# EAGLE design DMX module (EAGLE 8.7.1)
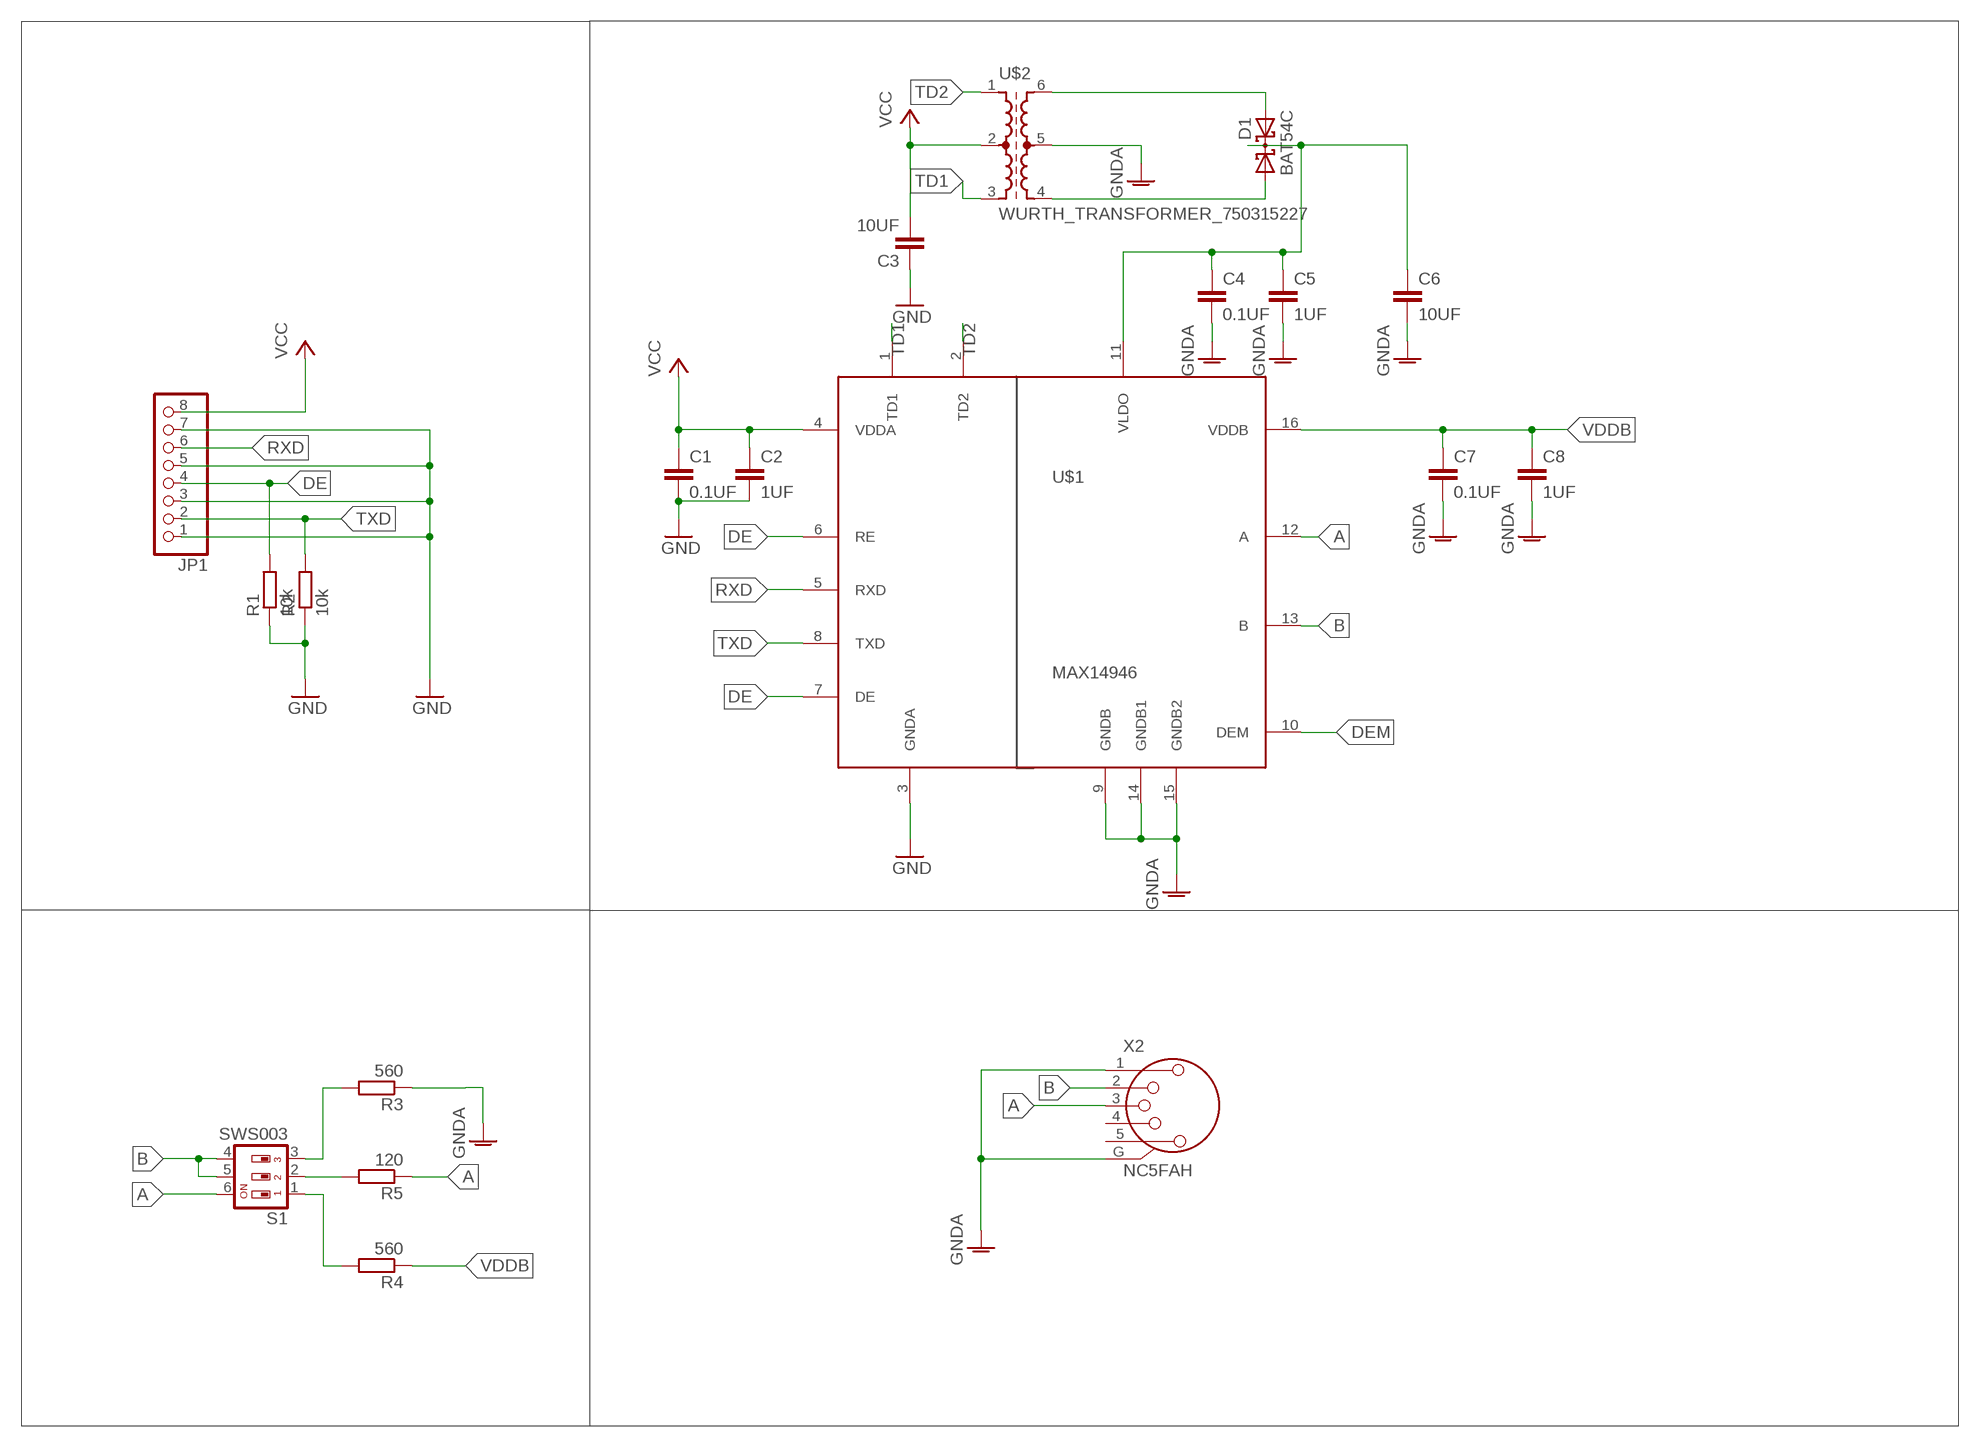
[diagram p0: schematic, sheet 1]

## Parts
C1  0.1UF  C-EUC0603  [C0603]
C2  1UF  C-EUC0603  [C0603]
C3  10UF  C-EUC0805  [C0805]
C4  0.1UF  C-EUC0603  [C0603]
C5  1UF  C-EUC0603  [C0603]
C6  10UF  C-EUC0805  [C0805]
C7  0.1UF  C-EUC0603  [C0603]
C8  1UF  C-EUC0603  [C0603]
D1  BAT54C  [SOT23]
JP1  PINHD-1X8/90  [1X08/90]
R1  10k  R-EU_R0603  [R0603]
R2  10k  R-EU_R0603  [R0603]
R3  560  R-EU_R0603  [R0603]
R4  560  R-EU_R0603  [R0603]
R5  120  R-EU_R0603  [R0603]
S1  SWS003  [SMS-003]
U$1  MAX14946  [SOIC16W]
U$2  WURTH_TRANSFORMER_750315227  [WURTH750315227]
X2  NC5FAH  [NC5FAH]

## Nets
A: R5.1 S1.6 U$1.12(A) X2.3
B: S1.4 S1.5 U$1.13(B) X2.2
DE: JP1.4 R1.2 U$1.6(RE) U$1.7(DE)
DEM: U$1.10(DEM)
GND: C1.2 C2.2 C3.1 JP1.1 JP1.3 JP1.5 JP1.7 R1.1 R2.1 U$1.3(GNDA)
GNDA: C4.2 C5.2 C6.2 C7.2 C8.2 R3.1 U$1.9(GNDB) U$1.14(GNDB1) U$1.15(GNDB2) U$2.5 X2.1 X2.G
N$1: R5.2 S1.2
N$2: R4.2 S1.1
N$3: D1.1(A1) U$2.4
N$4: D1.2(A2) U$2.6
N$5: C4.1 C5.1 C6.1 D1.3(CC) U$1.11(VLDO)
N$6: R3.2 S1.3
RXD: JP1.6 U$1.5(RXD)
TD1: U$1.1(TD1) U$2.3
TD2: U$1.2(TD2) U$2.1
TXD: JP1.2 R2.2 U$1.8(TXD)
VCC: C1.1 C2.1 C3.2 JP1.8 U$1.4(VDDA) U$2.2
VDDB: C7.1 C8.1 R4.1 U$1.16(VDDB)
Unconnected: X2.4 X2.5

## Library data of the parts
C1 C4 C7 = rcl:C-EU: CAPACITOR, European symbol; MF: AVX; MPN: 06033C104KAT2A; SPICEPREFIX: C
C2 C5 C8 = rcl:C-EU: CAPACITOR, European symbol; MF: AVX; MPN: 0603YC105KAT4A; SPICEPREFIX: C
C3 C6 = rcl:C-EU: CAPACITOR, European symbol; MF: AVX; MPN: 08056G106ZAT2A; SPICEPREFIX: C
D1 = diode:BAT54C: Schottky Diodes Source: Fairchild .. BAT54.pdf; MF: ROHM Semiconductor; MPN: 755-BAT54AHMFHT116
JP1 = pinhead:PINHD-1X8: PIN HEADER; MF: CONNFLY; MPN: DS1022-1*20RDF1-1
R1 R2 = rcl:R-EU_: RESISTOR, European symbol; MF: Yageo; MPN: RC0603JR-0710KA; SPICEPREFIX: R
R3 R4 = rcl:R-EU_: RESISTOR, European symbol; MF: Yageo; MPN: RC0603FR-13560RL; SPICEPREFIX: R
R5 = rcl:R-EU_: RESISTOR, European symbol; MF: Yageo; MPN: RC0603FR-10120RL; SPICEPREFIX: R
S1 = smd-special:SWS003: SMD Dip Switch 3 pol.; MF: CTS Electronic Components; MPN: 774-2193MST
U$1 = maxim_jw:MAX14946: Isolated 500kbps Half-Duplex RS-485/RS-422 Transceiver with ±30kV ESD Protection and Integrated Transformer Driver; MF: Maxim; MPN: 700-MAX14946EWE+
U$2 = maxim_jw:WURTH_TRANSFORMER_750315227; MF: Wurth Electronics; MPN: 710-750315227
X2 = con-neutrik_ag:NC5: Neutrik Audio Connector XLR SERIES Stereo 1/4" jack Source: www.neutrik.com/; MF: Neutrik; MPN: NC5FAH; OC_FARNELL: 8020418; OC_NEWARK: 38K6010

## Net classes
0 default: width 0.406 mm, drill 0.4 mm, clearance 0.305 mm

## Board
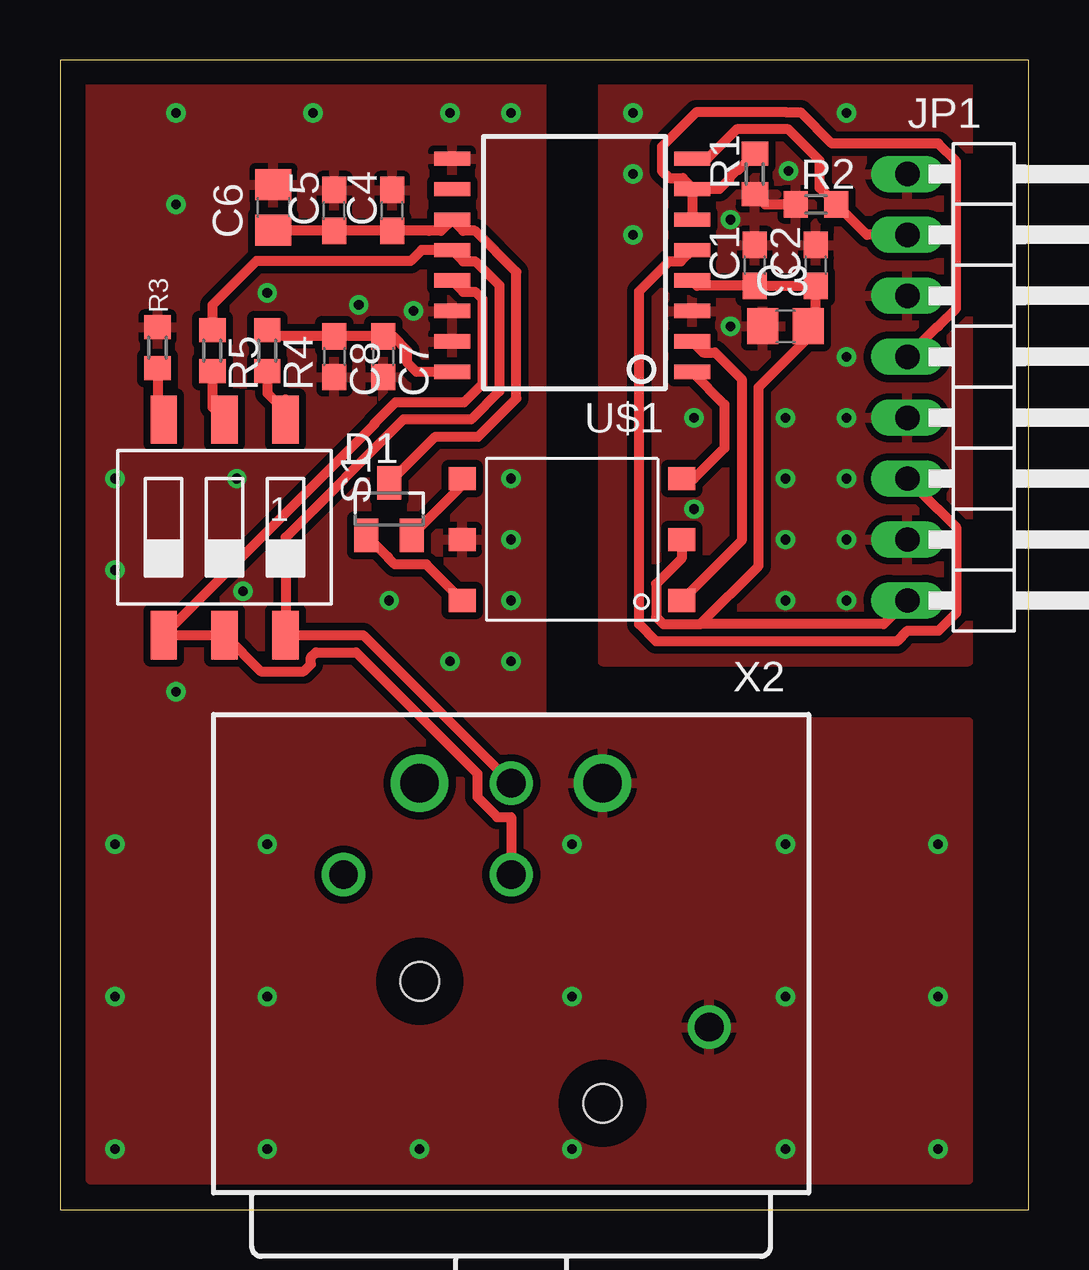
[diagram p1: board, top side]
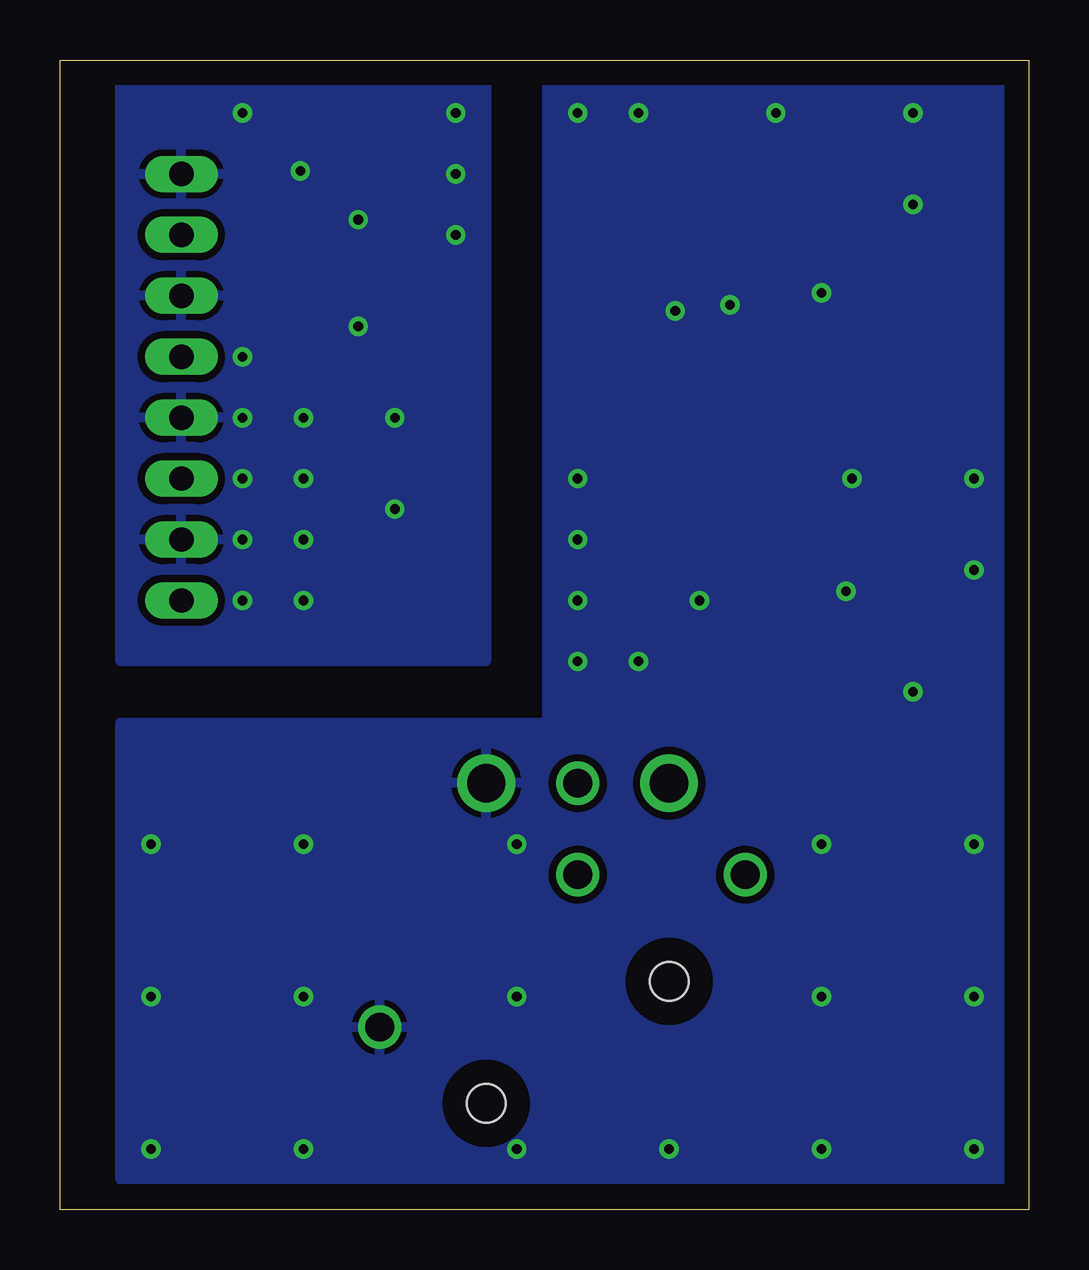
[diagram p2: board, bottom side, seen from below]

Size 40.37 x 47.93 mm. Coordinates in mm from the lower left corner, seen from the top.
Outline: 0,0 40.37,0 40.37,47.93 0,47.93 0,0
Copper layers (1*16): Top 0.035mm / dielectric 1.5mm / Bottom 0.035mm
Design rules "default *": minimum track width 6mil, minimum drill 0.35mm, track to track 6mil, track to pad 6mil, pad to pad 6mil, via to via 10mil, smd to smd 6mil, copper to edge 40mil, drill to drill 6mil, minimum pad ring 10mil, minimum via ring 8mil, stop-mask expansion 4mil, vias tented up to drill 0mil, thermal gap 10mil

### Footprints (pad centres in the part's own frame; a part is rotated, then mirrored left to right if it is on the bottom)
C0603 = smd 1.1 x 1: 1 -0.85,0; 2 0.85,0
C0805 = smd 1.3 x 1.5: 1 -0.95,0; 2 0.95,0
SOT23 = smd 1 x 1.4: 1 -0.95,-1.1; 2 0.95,-1.1; 3 0,1.1
1X08/90 = drill 1.016 long: 1 -8.89,-3.81; 2 -6.35,-3.81; 3 -3.81,-3.81; 4 -1.27,-3.81; 5 1.27,-3.81; 6 3.81,-3.81; 7 6.35,-3.81; 8 8.89,-3.81
R0603 = smd 1 x 1.1: 1 -0.85,0; 2 0.85,0
SMS-003 = smd 1.092 x 2.007: 1 -2.54,-4.496; 2 0,-4.496; 3 2.54,-4.496; 4 2.54,4.496; 5 0,4.496; 6 -2.54,4.496
SOIC16W = smd 0.6 x 1.5: 1 -5.715,-5; 2 -4.445,-5; 3 -3.175,-5; 4 -1.905,-5; 5 -0.635,-5; 6 0.635,-5; 7 1.905,-5; 8 3.175,-5; 9 3.175,5; 10 1.905,5; 11 0.635,5; 12 -0.635,5; 13 -1.905,5; 14 -3.175,5; 15 -4.445,5; 16 -5.715,5
WURTH750315227 = smd 1.12 x 0.96: 1 -4.57,2.54; 2 -4.57,0; 3 -4.57,-2.54; 4 4.57,2.54; 5 4.57,0; 6 4.57,-2.54
NC5FAH = drill 1.6: 1 -3.81,-3.815; 5 3.81,-3.815 | drill 1.2: 2 0,0; 3 0,-3.815; 4 6.98,0; G -8.25,6.355 | hole 1.6: 3.81,4.445; -3.81,9.525

### Placement (x,y rotation side)
C1  28.96,39.37 90 top
C2  31.5,39.37 90 top
C3  30.23,36.83 0 top
C4  13.84,41.66 90 top
C5  11.43,41.66 90 top
C6  8.89,41.78 90 top
C7  13.46,35.56 270 top
C8  11.43,35.56 270 top
D1  13.72,29.21 0 top
JP1  39.12,34.29 270 top
R1  28.96,43.18 90 top
R2  31.5,41.91 0 top
R3  4.06,35.94 270 top
R4  8.64,35.81 270 top
R5  6.35,35.81 270 top
S1  6.86,28.45 180 top
U$1  21.34,40.64 90 top
U$2  21.34,27.94 180 top
X2  18.8,13.97 180 top

### Tracks (layer width: path | path; a pad name or v marks a point on that pad's centre or on a via)
A
  Top 0.406: X2.3 12.63,23.95 S1.6 9.4,28.03 14.31,32.94 17.13,32.94 18.3,34.12 18.3,38.53 17.3,39.54 16.8,39.54 U$1.12 15.06,40.01 14.61,39.55 8.18,39.55 6.35,37.72 R5.1
B
  Top 0.406: U$1.13 16.8,38.27 17.3,38.27 17.59,37.98 17.59,34.41 16.83,33.65 13.97,33.65 13.11,32.79 13.11,32.74 S1.4 S1.5 8.37,22.44 10.16,22.44 10.45,22.74 10.45,23.02 10.67,23.24 12.33,23.24 17.39,18.19 17.39,17.2 18.21,16.38 18.79,16.38 18.8,16.37 X2.2
DE
  Top 0.406: 26.42,42.55 27.47,42.55 27.9,42.97 27.9,43.04 28.2,43.34 28.26,43.34 R1.2 | 26.42,42.55 U$1.7 U$1.6 | 26.42,42.55 25.95,43.01 25.38,43.01 25.08,43.3 25.08,44.33 26.5,45.75 30.27,45.75 30.86,45.75 32.16,44.45 36.59,44.45 37.34,43.71 37.34,37.57 36.59,36.83 36.58,36.83 JP1.4
GND  (via drill 0.4)
  Top 0.406: R1.1 29.38,41.91 R2.1
  other vias: 23.88,45.72 30.23,30.48 23.88,43.18 23.88,40.64 27.94,41.27 32.77,25.4 30.23,25.4 26.42,29.21 26.42,33.02 30.23,33.02 30.23,27.94 32.77,27.94 32.77,30.48 32.77,33.02 32.77,35.56 27.94,36.83 32.77,45.72 30.35,43.31
  pour Top: 22.61,46.99 22.61,22.86 37.85,22.86 37.85,46.99
  pour Bottom: 22.61,46.99 22.61,22.86 37.85,22.86 37.85,46.99
GNDA  (via drill 0.4)
  other vias: 4.83,45.72 16.26,45.72 18.8,45.72 4.83,41.91 14.73,37.47 4.83,21.59 2.29,15.24 2.29,8.89 2.29,2.54 8.64,15.24 21.34,15.24 36.58,15.24 36.58,8.89 30.23,15.24 21.34,8.89 30.23,8.89 30.23,2.54 36.58,2.54 21.34,2.54 14.99,2.54 8.64,2.54 8.64,8.89 12.45,37.72 13.72,25.4 16.26,22.86 18.8,22.86 18.8,25.4 18.8,27.94 18.8,30.48 2.29,30.48 7.37,30.48 2.29,26.67 7.62,25.78 10.54,45.72 8.64,38.23
  pour Top: 1.27,47.24 1.27,1.27 37.85,1.27 37.85,20.32 20.07,20.32 20.07,46.99
  pour Bottom: 1.02,46.99 1.02,1.27 37.85,1.27 37.85,20.32 20.07,20.32 20.07,46.99
N$1
  Top 0.406: R5.2 6.35,33.45 S1.2
N$2
  Top 0.406: 9.4,33.78 9.4,33.27 | 9.4,33.27 S1.1 | R4.2 8.64,34.04 9.4,33.27
N$3
  Top 0.406: U$2.4 15.26,26.9 13.96,26.9 13.66,27.2 13.66,27.22 D1.1
N$4
  Top 0.406: D1.2 16.77,30.21 U$2.6
N$5
  Top 0.406: C6.1 8.92,40.81 C5.1 C4.1 14.1,40.81 15.38,40.81 15.87,40.81 U$1.11 16.8,40.81 17.3,40.81 19.02,39.09 19.02,33.83 17.42,32.23 15.64,32.23 D1.3
N$6
  Top 0.406: R3.2 4.06,33.2 S1.3
RXD
  Top 0.406: U$1.5 25.87,39.54 25.38,39.54 24.13,38.29 24.13,24.41 24.84,23.7 34.88,23.7 35.31,24.13 36.59,24.13 37.34,24.87 37.34,28.47 36.59,29.21 36.58,29.21 JP1.6
TD1
  Top 0.406: U$1.1 27.69,33.58 27.69,31.75 26.42,30.48 U$2.3
TD2
  Top 0.406: U$1.2 26.8,35.73 27.3,35.73 28.4,34.63 28.4,27.89 U$2.1
TXD
  Top 0.406: U$1.8 26.97,43.81 28.2,45.04 30.35,45.04 31.65,43.73 31.65,42.6 R2.2 33.62,40.64 JP1.2
VCC
  Top 0.406: U$1.4 26.55,38.52 C1.1 C2.1 | C2.1 31.6,38.42 | 26.68,24.41 26.42,24.41 25.14,24.41 24.84,24.71 24.84,26.09 25.91,27.16 U$2.2 | 26.68,24.41 29.11,26.84 29.11,34.29 31.18,36.36 C3.2 | 31.5,36.51 C3.2 | C3.2 31.5,37.15 C2.1 | JP1.8 34.32,24.41 26.68,24.41
VDDB
  Top 0.406: U$1.16 14.86,34.92 14.48,35.31 14.48,35.81 13.88,36.41 C7.1 C8.1 8.89,36.41 R4.1